# EAGLE design bb313_v10d (EAGLE 5.06)
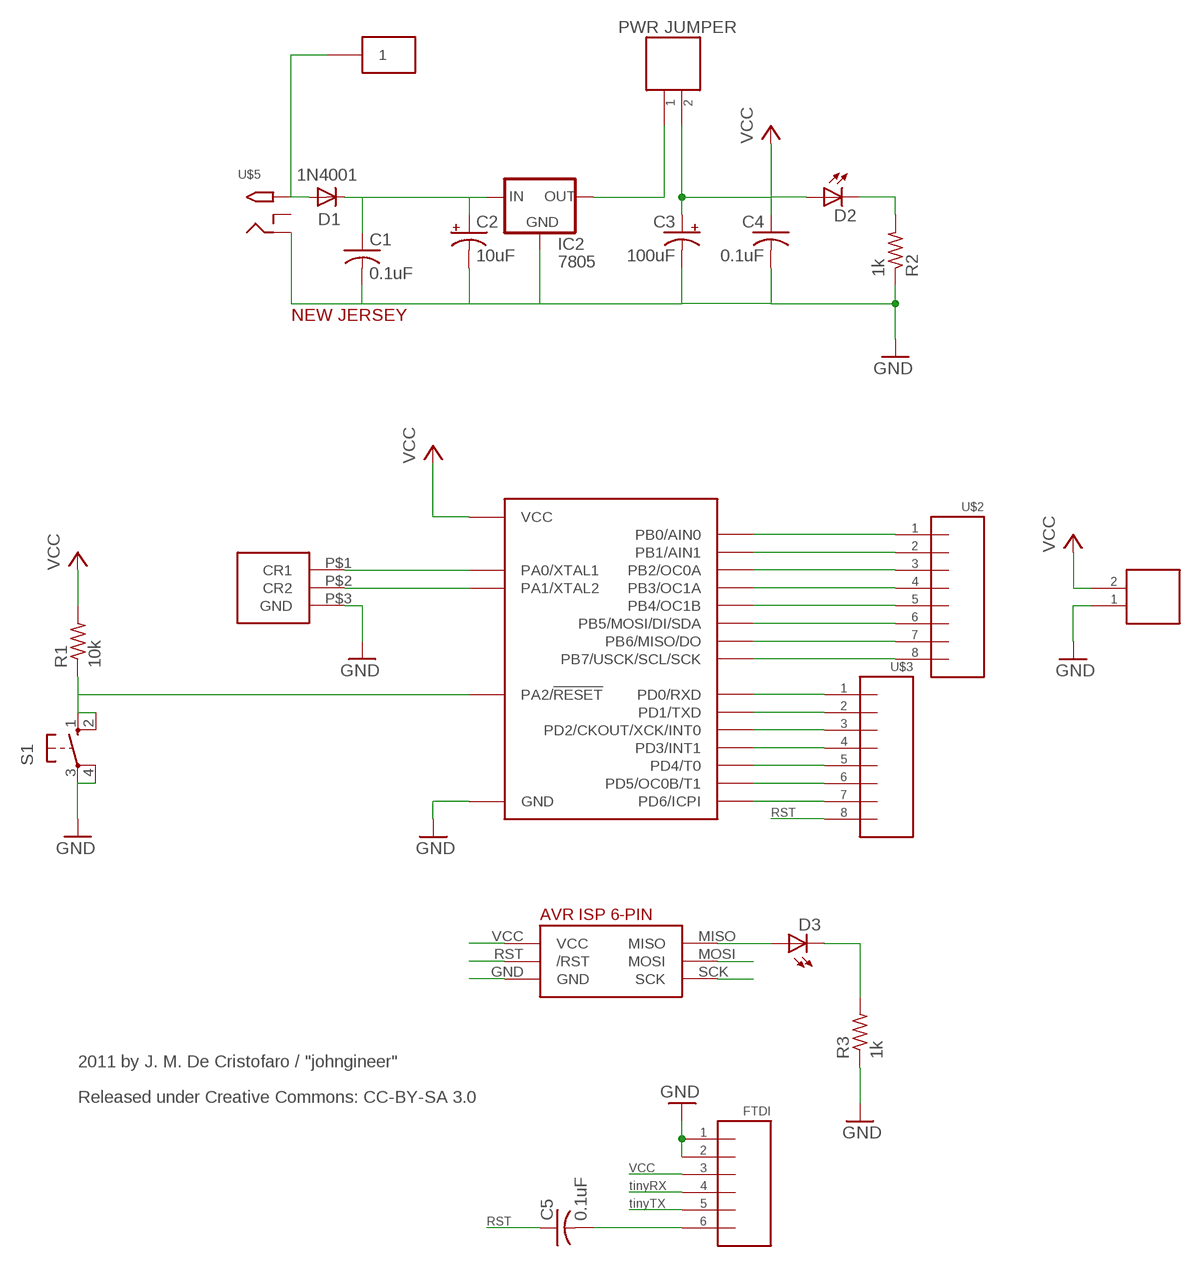
[diagram p0: schematic, sheet 1]

## Parts
C1  0.1uF  C-US025-025X050  [C025-025X050]
C2  10uF  CPOL-USE2.5-5  [E2,5-5]
C3  100uF  CPOL-USE2.5-5  [E2,5-5]
C4  0.1uF  C-US025-030X050  [C025-030X050]
C5  0.1uF  C-US025-030X050  [C025-030X050]
CR1  CR  CERAM_RES  [CERAM_RES]
D1  1N4001  1N4004  [DO41-10]
D2  LED3MM  [LED3MM]
D3  LED3MM  [LED3MM]
FTDI  6PIN_HEADER  [6PIN_HEADER]
IC1  ATTINY2313/4313  [ATTINY2313/4313]
IC2  7805  78XXS  [78XXS]
R1  10k  R-US_0204/5  [0204/5]
R2  1k  R-US_0204/5  [0204/5]
R3  1k  R-US_0204/5  [0204/5]
S1  10-XX  [B3F-10XX]
U$1  2PIN_HEADER  [2PIN_HEADER]
U$2  8PIN_HEADER  [8PIN_HEADER]
U$3  8PIN_HEADER  [8PIN_HEADER]
U$4  AVR_ISP_6_SMALL  [AVR_ISP6_SMALL]
U$5  2.1MMJACKTHM  [PJ-102A]
U$6  2PIN_HEADER_SHORTABLE  [2PIN_HEADER_SHORTABLE]
U$7  NJ_OUTLINE  [NJ_OUTLINE]
U$8  1PIN_HEADER  [1PIN_HEADER]

## Nets
GND: C1.2 C2.- C3.- C4.2 CR1.P$3(GND) FTDI.P$1 FTDI.P$2 IC1.P$10(GND) IC2.GND R2.1 R3.1 S1.3(P) S1.4(P1) U$1.P$1 U$4.GND U$5.RING
MISO: D3.A IC1.P$18(PB6/MISO/DO) U$2.P$7 U$4.MISO
MOSI: IC1.P$17(PB5/MOSI/DI/SDA) U$2.P$6 U$4.MOSI
N$1: IC1.P$12(PB0/AIN0) U$2.P$1
N$2: IC1.P$13(PB1/AIN1) U$2.P$2
N$3: IC1.P$14(PB2/OC0A) U$2.P$3
N$4: IC1.P$15(PB3/OC1A) U$2.P$4
N$5: IC1.P$16(PB4/OC1B) U$2.P$5
N$7: D2.K(C) R2.2
N$8: D1.A U$5.TIP U$8.P$1
N$11: IC1.P$6(PD2/CKOUT/XCK/INT0) U$3.P$3
N$12: IC1.P$7(PD3/INT1) U$3.P$4
N$13: IC1.P$8(PD4/T0) U$3.P$5
N$14: IC1.P$9(PD5/OC0B/T1) U$3.P$6
N$15: IC1.P$11(PD6/ICPI) U$3.P$7
N$17: C1.1 C2.+ D1.C IC2.IN
N$18: D3.K(C) R3.2
PA0: CR1.P$1(CR1) IC1.P$5(PA0/XTAL1)
PA1: CR1.P$2(CR2) IC1.P$4(PA1/XTAL2)
RST: C5.1 IC1.P$1(PA2/!RESET) R1.1 S1.1(S) S1.2(S1) U$3.P$8 U$4.RST(/RST)
RTS: C5.2 FTDI.P$6
RX: FTDI.P$4 IC1.P$2(PD0/RXD) U$3.P$1
SCK: IC1.P$19(PB7/USCK/SCL/SCK) U$2.P$8 U$4.SCK
SUPPLY: IC2.OUT U$4.VCC U$6.P$1
TX: FTDI.P$5 IC1.P$3(PD1/TXD) U$3.P$2
VCC: C3.+ C4.1 D2.A FTDI.P$3 IC1.P$20(VCC) R1.2 U$1.P$2 U$6.P$2
Unconnected: U$5.RING_SW

## Notes on the sheet
- PWR JUMPER
- RST
- 2011 by J. M. De Cristofaro / "johngineer"
- Released under Creative Commons: CC-BY-SA 3.0
- VCC
- tinyRX
- tinyTX
- RST

## Library data of the parts
C1 = resistor:C-US: CAPACITOR, American symbol
C2 C3 = adafruit:CPOL-US: POLARIZED CAPACITOR, American symbol
C4 C5 = adafruit:C-US: CAPACITOR, American symbol
CR1 = jmd:CERAM_RES
D1 = adafruit:1N4004: DIODE General purpose 1N400x type rectifier (With bigger pads) http://www.ladyada.net/library/pcb/eaglelibrary.html
D2 D3 = led:LED: LED OSRAM: - CHIPLED LG R971, LG N971, LY N971, LG Q971, LY Q971, LO R971, LY R971 LH N974, LH R974 LS Q976, LO Q976, LY Q976 LO Q996 - Hyper CHIPLED LW Q18S LB Q993, LB Q99A, LB R99A - SideLED LS A670, LO A670, LY A670, LG A670, LP A670 LB A673, LV A673, LT A673, LW A673 LH A674 LY A675 LS A676, LA A676, LO A676, LY A676, LW A676 LS A679, LY A679, LG A679 - Hyper Micro SIDELED® LS Y876, LA Y876, LO Y876, LY Y876 LT Y87S - SmartLED LW L88C, LW L88S LB L89C, LB L89S, LG L890 LS L89K, LO L89K, LY L89K LS L896, LA L896, LO L896, LY L896 - TOPLED LS T670, LO T670, LY T670, LG T670, LP T670 LSG T670, LSP T670, LSY T670, LOP T670, LYG T670 LG T671, LOG T671, LSG T671 LB T673, LV T673, LT T673, LW T673 LH T674 LS T676, LA T676, LO T676, LY T676, LB T676, LH T676, LSB T676, LW T676 LB T67C, LV T67C, LT T67C, LS T67K, LO T67K, LY T67K, LW E67C LS E67B, LA E67B, LO E67B, LY E67B, LB E67C, LV E67C, LT E67C LW T67C LS T679, LY T679, LG T679 LS T770, LO T770, LY T770, LG T770, LP T770 LB T773, LV T773, LT T773, LW T773 LH T774 LS E675, LA E675, LY E675, LS T675 LS T776, LA T776, LO T776, LY T776, LB T776 LHGB T686 LT T68C, LB T68C - Hyper Mini TOPLED® LB M676 - Mini TOPLED Santana® LG M470 LS M47K, LO M47K, LY M47K Source: http://www.osram.convergy.de LUXEON: - LUMILED® LXK2-PW12-R00, LXK2-PW12-S00, LXK2-PW14-U00, LXK2-PW14-V00 LXK2-PM12-R00, LXK2-PM12-S00, LXK2-PM14-U00 LXK2-PE12-Q00, LXK2-PE12-R00, LXK2-PE12-S00, LXK2-PE14-T00, LXK2-PE14-U00 LXK2-PB12-K00, LXK2-PB12-L00, LXK2-PB12-M00, LXK2-PB14-N00, LXK2-PB14-P00, LXK2-PB14-Q00 LXK2-PR12-L00, LXK2-PR12-M00, LXK2-PR14-Q00, LXK2-PR14-R00 LXK2-PD12-Q00, LXK2-PD12-R00, LXK2-PD12-S00 LXK2-PH12-R00, LXK2-PH12-S00 LXK2-PL12-P00, LXK2-PL12-Q00, LXK2-PL12-R00 Source: www.luxeon.com KINGBRIGHT: KA-3528ASYC Source: www.kingbright.com
FTDI = arduino:6PIN_HEADER
IC1 = jmd:ATTINY2313/4313
IC2 = v-reg:78XXS: VOLTAGE REGULATOR
R1-R3 = resistor:R-US_: RESISTOR, American symbol
S1 = switch-omron:10-XX: OMRON SWITCH
U$1 = arduino:2PIN_HEADER
U$2 U$3 = arduino:8PIN_HEADER
U$4 = jmd:AVR_ISP_6_SMALL
U$5 = adafruit:2.1MMJACK: 2.1mm x 5.5mm THM DC jack with internal switch. Digikey part #PJ-102A, 4UCON part #05537 2.1mm x 5.5mm SMT DC jack with internal switch. Digikey part #PJ-002A-SMT, 4UCON part #03267 By microbuilder.eu & adafruit.com
U$6 = arduino:2PIN_HEADER_SHORTABLE
U$7 = jmd:NJ_OUTLINE
U$8 = arduino:1PIN_HEADER

## Board
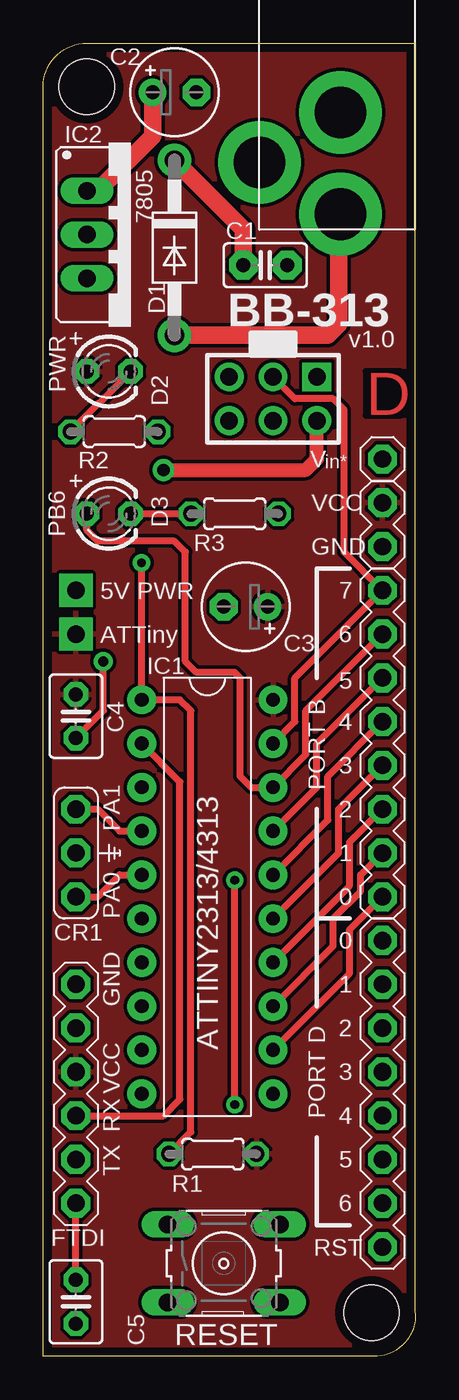
[diagram p1: board, top side]
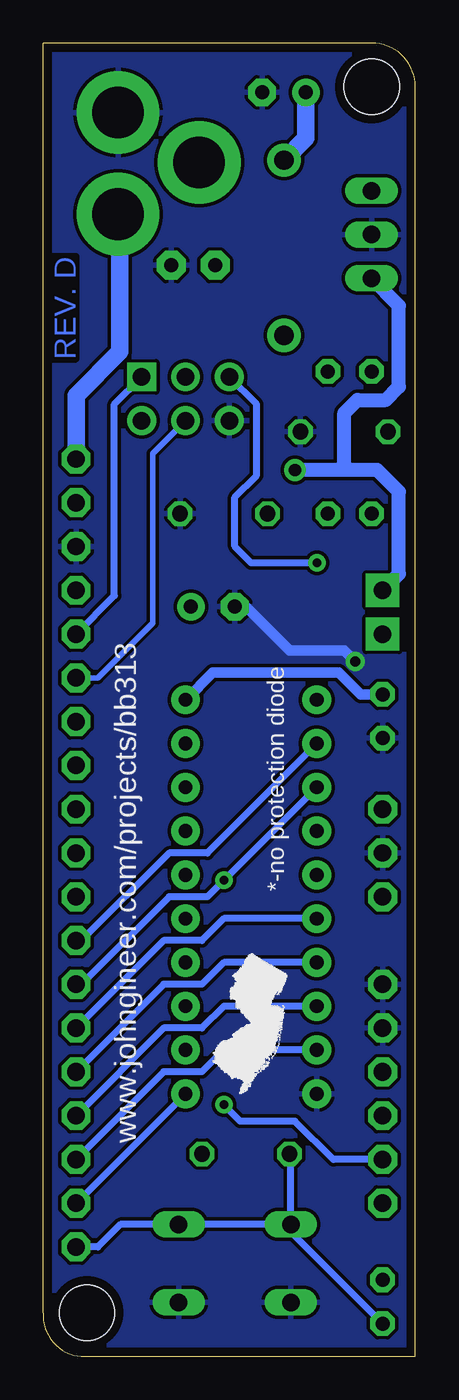
[diagram p2: board, bottom side, seen from below]

Size 21.59 x 76.2 mm. Coordinates in mm from the lower left corner, seen from the top.
Outline: 21.59,2.54 arc-90 19.37,0 0,0 0,73.66 arc-90 2.54,76.2 21.59,76.2 21.59,2.54
Copper layers (1*16): Top 0.035mm / dielectric 1.5mm / Bottom 0.035mm
Design rules "PCBCart-Standard": minimum track width 8mil, minimum drill 0.4mm, track to track 8mil, track to pad 8mil, pad to pad 8mil, via to via 8mil, smd to smd 8mil, copper to edge 20mil, drill to drill 8mil, minimum pad ring 8mil, minimum via ring 10mil, stop-mask expansion 3mil, vias tented up to drill 0mil, thermal gap 8mil
Holes 3.2 mm at 2.54,73.66 19.05,2.54

### Footprints (pad centres in the part's own frame; a part is rotated, then mirrored left to right if it is on the bottom)
C025-025X050 = drill 0.813 pad 1.676 octagon: 1 -1.27,0; 2 1.27,0
E2,5-5 = drill 0.813 pad 1.6 round: + -1.27,0 | drill 0.813 pad 1.6 octagon: - 1.27,0
C025-030X050 = drill 0.813 pad 1.422 octagon: 1 -1.27,0; 2 1.27,0
CERAM_RES = drill 1 pad 1.676 octagon: P$1 0,2.54; P$2 0,-2.54; P$3 0,0
DO41-10 = drill 1.118 pad 1.93 round: A 5.08,0; C -5.08,0
LED3MM = drill 0.813 pad 1.422 octagon: A -1.27,0; K 1.27,0
6PIN_HEADER = drill 1.016 pad 1.676 octagon: P$1 0,0; P$2 2.54,0; P$3 5.08,0; P$4 7.62,0; P$5 10.16,0; P$6 12.7,0
ATTINY2313/4313 = drill 0.8 pad 1.676 round: P$1 -3.81,11.43; P$2 -3.81,8.89; P$3 -3.81,6.35; P$4 -3.81,3.81; P$5 -3.81,1.27; P$6 -3.81,-1.27; P$7 -3.81,-3.81; P$8 -3.81,-6.35; P$9 -3.81,-8.89; P$10 -3.81,-11.43; P$11 3.81,-11.43; P$12 3.81,-8.89; P$13 3.81,-6.35; P$14 3.81,-3.81; P$15 3.81,-1.27; P$16 3.81,1.27; P$17 3.81,3.81; P$18 3.81,6.35; P$19 3.81,8.89; P$20 3.81,11.43
78XXS = drill 1.016 long: GND 0,-2.54; IN -2.54,-2.54; OUT 2.54,-2.54
0204/5 = drill 0.914 pad 1.422 octagon: 1 -2.54,0; 2 2.54,0
B3F-10XX = drill 1.016 long: 1 -3.251,2.261; 2 3.251,2.261; 3 -3.251,-2.261; 4 3.251,-2.261
2PIN_HEADER = drill 1 pad 1.676 octagon: P$1 0,0; P$2 0,2.54
8PIN_HEADER = drill 1.016 pad 1.676 octagon: P$1 0,0; P$2 2.54,0; P$3 5.08,0; P$4 7.62,0; P$5 10.16,0; P$6 12.7,0; P$7 15.24,0; P$8 17.78,0
AVR_ISP6_SMALL = drill 1.016 pad 1.676 round: GND -2.54,-1.27; MOSI 0,-1.27; RST -2.54,1.27; SCK 0,1.27; VCC 2.54,-1.27 | drill 1.016 pad 1.676 square: MISO 2.54,1.27
PJ-102A = drill 3 pad 4.8 round: RING 0.1,-3.39; RING_SW -4.6,-6.29; TIP 0.1,-9.29
2PIN_HEADER_SHORTABLE = drill 1.016 pad 1.93 square: P$1 0,0; P$2 2.54,0
1PIN_HEADER = drill 1 pad 1.676 octagon: P$1 0,0

### Placement (x,y rotation side)
C1  12.89,63.31 0 top
C2  7.62,73.34 0 top
C3  11.75,43.5 180 top
C4  1.91,37.15 270 top
C5  1.91,3.17 90 top
CR1  1.91,29.21 180 top
D1  7.62,64.33 270 top
D2  3.81,57.15 0 top
D3  3.81,48.9 0 top
FTDI  1.91,21.59 270 top
IC1  9.53,26.67 0 top
IC2  5.08,65.09 270 top
R1  9.84,11.75 0 top
R2  4.13,53.66 180 top
R3  11.11,48.9 180 top
S1  10.48,5.4 0 top
U$1  19.68,46.99 0 top
U$2  19.68,26.67 90 top
U$3  19.68,24.13 270 top
U$4  13.34,55.56 0 top
U$5  17.14,75.56 0 top
U$6  1.91,44.45 270 top
U$7  11.75,15.24 0 bottom
U$8  19.68,52.07 0 top

### Tracks (layer width: path | path; a pad name or v marks a point on that pad's centre or on a via)
GND  (via drill 0.6)
  Top 0.406: v3.49,40.32 3.49,37.47 C4.2
  Bottom 0.61: C3.- 9.84,43.5 7.3,40.96 4.13,40.96 v3.49,40.32
  pour Bottom: 0,0 0,73.66 arc-90 2.54,76.2 21.59,76.2 21.59,2.54 arc-90 19.05,0
MISO
  Top 0.406: U$2.P$7 15.24,37.47 15.24,34.92 IC1.P$18 12.06,33.02 11.43,33.66 11.43,39.37 11.11,39.69 8.89,39.69 8.26,40.32 8.26,46.67 7.62,47.31 3.17,47.31 2.54,47.94 D3.A
  Bottom 0.406: U$4.MISO 17.46,55.24 17.46,44.13 U$2.P$7
MOSI
  Top 0.406: IC1.P$17 15.88,33.02 15.88,35.56 U$2.P$6
  Bottom 0.305: U$2.P$6 18.41,39.37 15.24,42.55 15.24,52.39 U$4.MOSI
N$1
  Top 0.406: IC1.P$12 17.78,22.23 17.78,24.77 U$2.P$1
N$2
  Top 0.406: IC1.P$13 16.83,23.81 16.83,25.4 18.41,26.99 18.41,27.94 U$2.P$2
N$3
  Top 0.406: IC1.P$14 17.78,27.3 17.78,29.84 U$2.P$3
N$4
  Top 0.406: IC1.P$15 17.14,29.21 17.14,31.75 U$2.P$4
N$5
  Top 0.406: IC1.P$16 16.51,31.11 16.51,33.66 U$2.P$5
N$7
  Top 0.406: R2.2 D2.K
N$8
  Top 1.016: D1.A 16.51,59.24 17.14,59.88 17.14,66.17 U$5.TIP
  Bottom 1.016: U$8.P$1 19.68,55.75 17.14,58.29 17.14,66.17 U$5.TIP
N$11
  Bottom 0.406: U$3.P$3 14.61,24.13 12.38,24.13 11.11,25.4 IC1.P$6
N$12
  Bottom 0.406: U$3.P$4 14.61,21.59 12.38,21.59 11.11,22.86 IC1.P$7
N$13
  Bottom 0.406: U$3.P$5 14.61,19.05 12.38,19.05 11.11,20.32 IC1.P$8
N$14
  Bottom 0.406: IC1.P$9 11.11,17.78 12.38,16.51 14.61,16.51 U$3.P$6
N$15
  Bottom 0.406: U$3.P$7 IC1.P$11
N$17
  Top 1.016: D1.C 11.62,65.41 C1.1 | IC2.IN 3.17,67.63 6.35,70.8 C2.+
  Bottom 1.016: D1.C 6.35,70.67 C2.+
N$18
  Top 0.406: D3.K R3.2
PA0
  Top 0.406: IC1.P$5 4.45,27.94 3.17,26.67 CR1.P$1
PA1
  Top 0.406: IC1.P$4 4.45,30.48 3.17,31.75 CR1.P$2
RST  (via drill 0.5)
  Top 0.406: R1.1 8.57,13.02 8.57,37.47 7.94,38.1 IC1.P$1 v5.71,46.04
  Bottom 0.406: S1.1 7.23,7.23 C5.1 | S1.1 S1.2 17.11,7.66 18.41,6.35 U$3.P$8 | R1.1 7.23,11.75 S1.1 | v5.71,46.04 9.53,46.04 10.48,46.99 10.48,49.85 9.21,51.12 9.21,55.24 U$4.RST
RTS
  Top 0.406: C5.2 FTDI.P$6
RX
  Top 0.406: FTDI.P$4 6.99,13.97 7.94,14.92 7.94,33.34 IC1.P$2
  Bottom 0.406: U$3.P$1 19.37,24.13 14.29,29.21 12.06,29.21 IC1.P$2
SCK
  Top 0.406: IC1.P$19 14.61,36.83 14.61,39.37 U$2.P$8 17.46,46.67 17.46,54.93 16.83,55.56 14.61,55.56 U$4.SCK
SUPPLY  (via drill 0.7 pad 1.27)
  Top 0.813: v6.99,51.44 15.24,51.44 15.88,52.07 U$4.VCC
  Bottom 0.813: IC2.OUT 0.95,60.96 0.95,56.26 1.71,55.5 3.37,55.5 4.13,54.74 4.13,51.75 4.45,51.44 | 4.45,51.44 2.22,51.44 0.95,50.16 0.95,45.4 U$6.P$1 | 4.45,51.44 v6.99,51.44
TX  (via drill 0.5 pad 0.81)
  Top 0.406: v11.11,14.61 v11.11,27.62
  Bottom 0.406: U$3.P$2 19.37,21.59 14.29,26.67 12.06,26.67 v11.11,27.62 IC1.P$3 | v11.11,14.61 10.16,13.65 6.99,13.65 4.76,11.43 FTDI.P$5
VCC
  Bottom 0.61: C4.1 3.17,38.42 4.45,39.69 11.75,39.69 IC1.P$20
  pour Top: 0,0 0,73.66 arc-90 2.54,76.2 21.59,76.2 21.59,2.54 arc-90 19.05,0

### Text on the board
Top: D
Bottom: REV. D
tPlace: VCC | GND | 7 | 6 | 5 | 4 | 3 | PORT B | 2 | 1 | 0 | 0 | 1 | 2 | 3 | PORT D | 4 | 5 | 6 | RST
tNames: 7805 | BB-313 | v1.0 | PWR | V | in* | PB6 | 5V PWR | ATTiny | PA1 | PA0 | GND | VCC | RX | TX | RESET
bNames: *-no protection diode | www.johngineer.com/projects/bb313
tStop: D